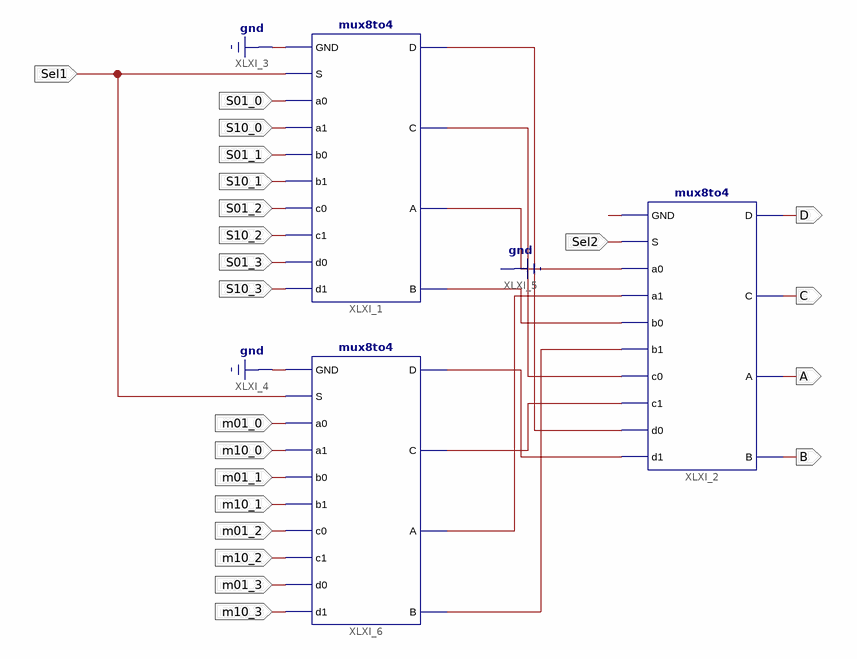
[diagram p0: schematic sheet 1]
// Xilinx ISE schematic MUX4_1_4.sch (spartan6) as structural Verilog: 3 symbols, 22 ports
module MUX4_1_4 (
  input  S10_3,
  input  Sel1,
  input  Sel2,
  input  S01_0,
  input  S10_0,
  input  S01_1,
  input  S10_1,
  input  S01_2,
  input  S10_2,
  input  S01_3,
  input  m01_0,
  input  m10_0,
  input  m01_1,
  input  m10_1,
  input  m01_2,
  input  m10_2,
  input  m01_3,
  input  m10_3,
  output D,
  output C,
  output A,
  output B
);

  wire XLXN_4, XLXN_5, XLXN_6, XLXN_7, XLXN_8, XLXN_9, XLXN_10, XLXN_11;

  mux8to4 XLXI_1 (
    .GND(1'b0), .S(Sel1), .a0(S01_0), .a1(S10_0), .b0(S01_1), .b1(S10_1), .c0(S01_2), .c1(S10_2), .d0(S01_3),
    .d1(S10_3), .D(XLXN_4), .C(XLXN_5), .A(XLXN_6), .B(XLXN_7));
  mux8to4 XLXI_2 (
    .GND(1'b0), .S(Sel2), .a0(XLXN_6), .a1(XLXN_10), .b0(XLXN_7), .b1(XLXN_11), .c0(XLXN_5), .c1(XLXN_9),
    .d0(XLXN_4), .d1(XLXN_8), .D(D), .C(C), .A(A), .B(B));
  mux8to4 XLXI_6 (
    .GND(1'b0), .S(Sel1), .a0(m01_0), .a1(m10_0), .b0(m01_1), .b1(m10_1), .c0(m01_2), .c1(m10_2), .d0(m01_3),
    .d1(m10_3), .D(XLXN_8), .C(XLXN_9), .A(XLXN_10), .B(XLXN_11));
endmodule
